# EAGLE design badge-pcb (EAGLE 7.7.0)
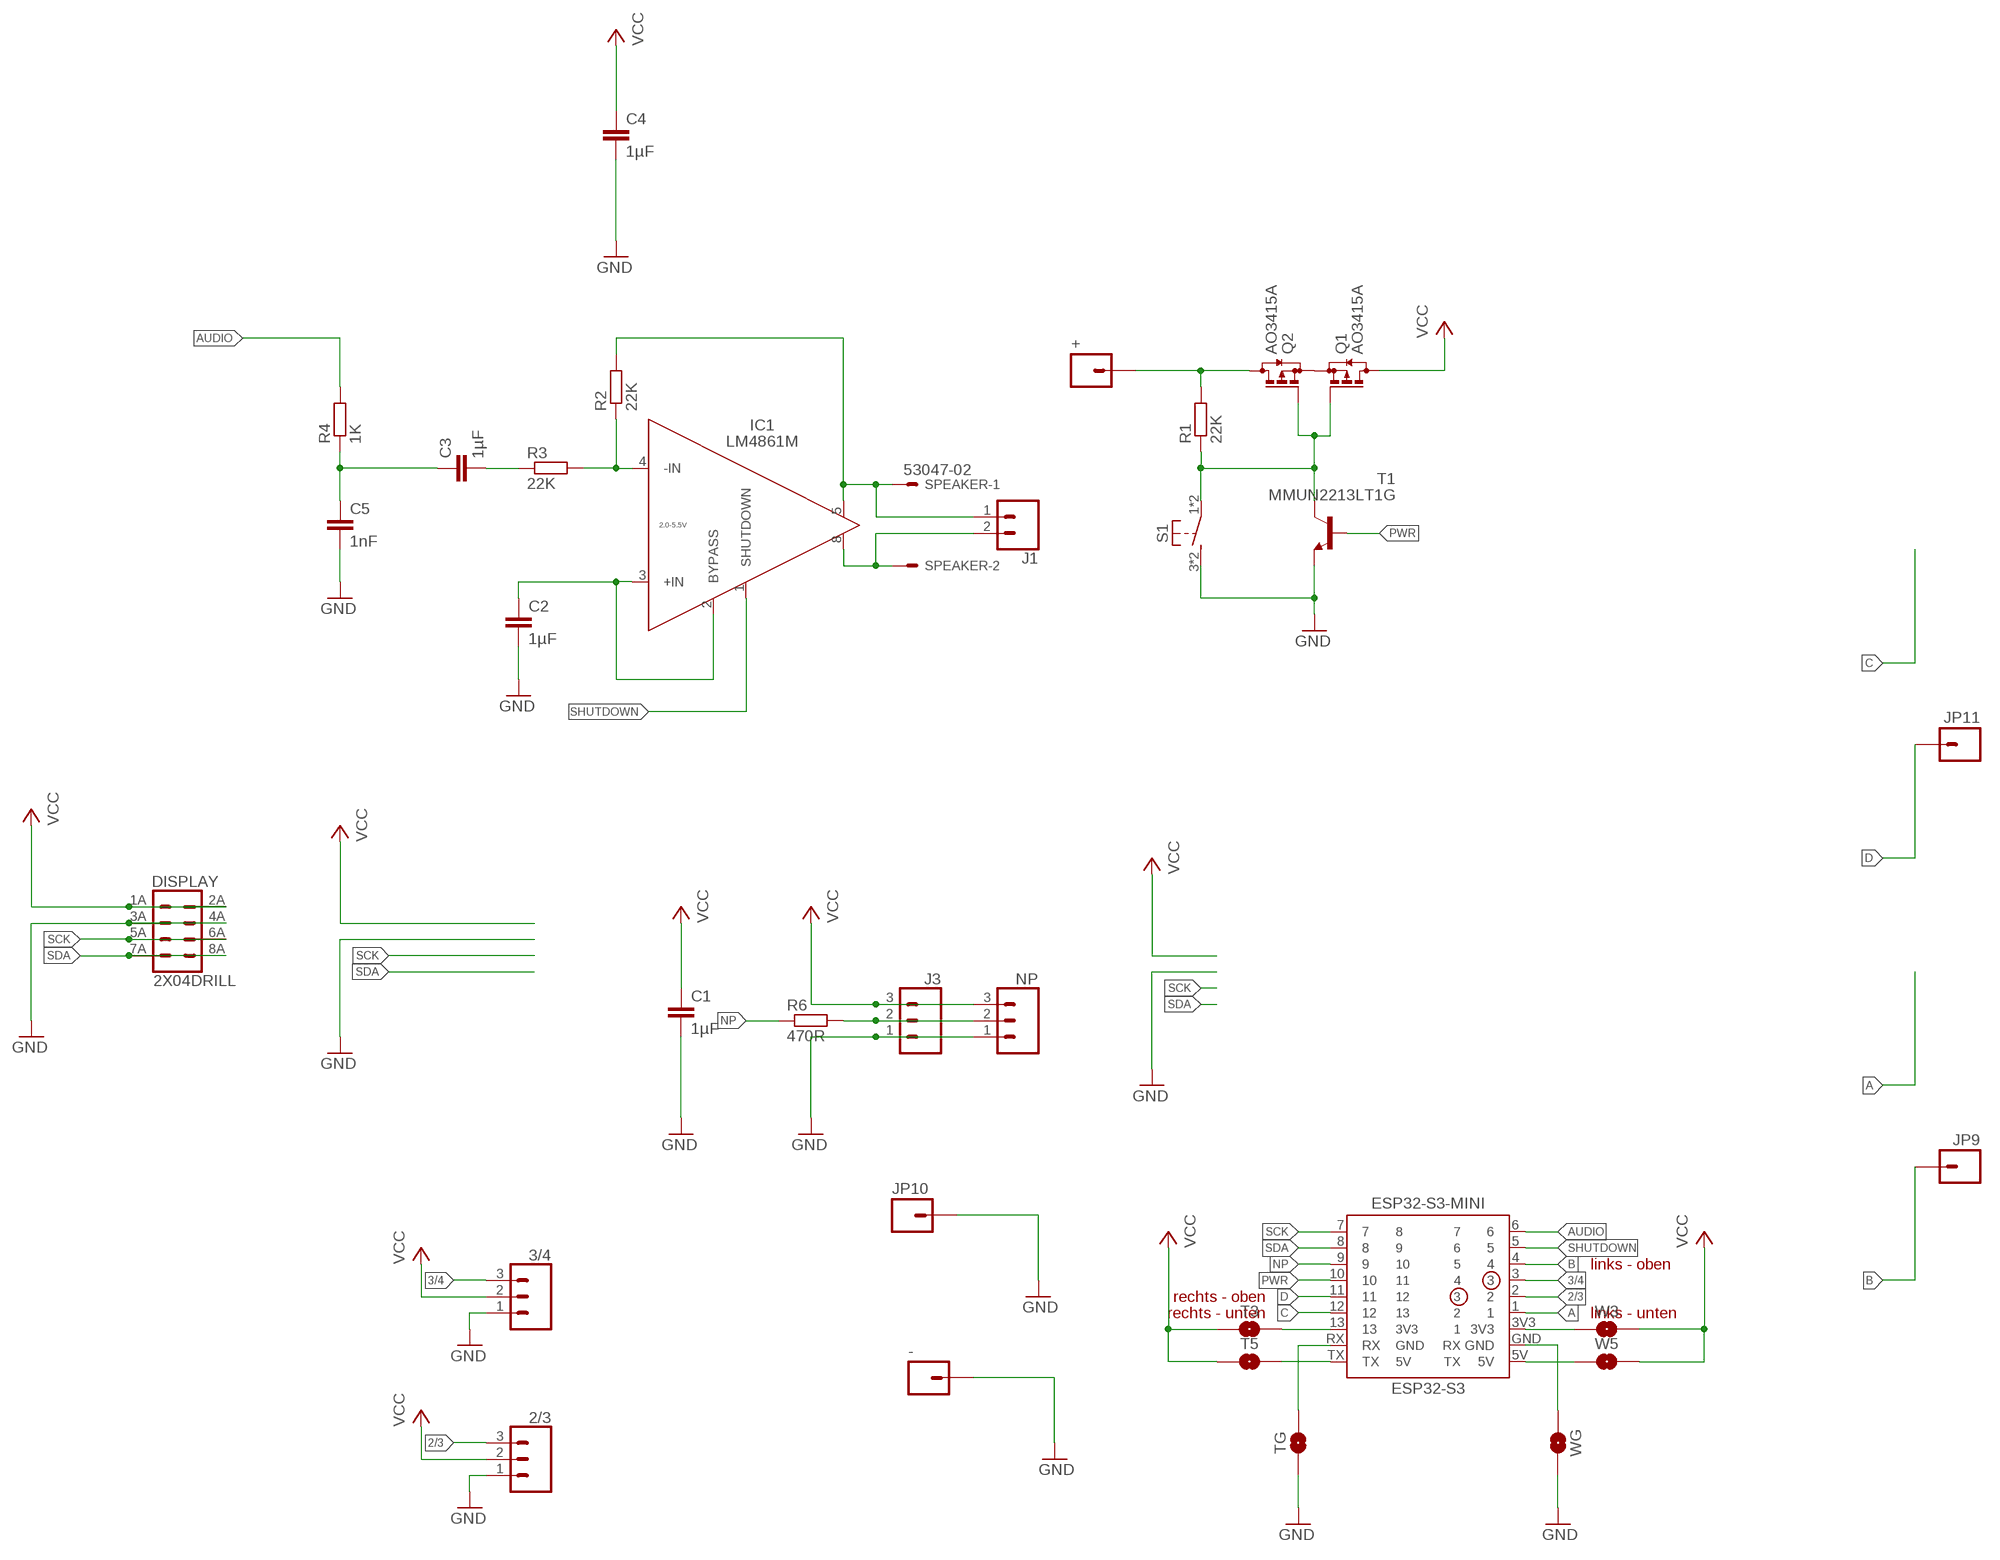
[diagram p0: schematic, sheet 1]

## Parts
2/3  455-1750-1-ND  CONN_03  [1X03]
3/4  455-1750-1-ND  CONN_03  [1X03]
+  M01OFFSET  [1X01_OFFSET]
-  M01OFFSET  [1X01_OFFSET]
C1  1µF  C-EUC0603K  [C0603K]
C2  1µF  C-EUC0603K  [C0603K]
C3  1µF  C-EUC0603K  [C0603K]
C4  1µF  C-EUC0603K  [C0603K]
C5  1nF  C-EUC0603K  [C0603K]
DISPLAY  2X04DRILL  [2X4-DRILL]
ESP32-S3  ESP32-S3-MINI  [ESP32-S3-MINI]
IC1  LM4861M  [SOIC8]
J1  CONN_02  [1X02]
J3  455-1750-1-ND  CONN_03LONGPADS  [1X03_LONGPADS]
JP9  M01OFFSET  [1X01_OFFSET]
JP10  M01PTH  [M01_1X01]
JP11  M01OFFSET  [1X01_OFFSET]
NP  455-1750-1-ND  CONN_03LONGPADS  [1X03_LONGPADS]
Q1  AO3415A  P-CHANNEL_MOSFETIRLML2244TRPBF  [SOT23-3PIN]
Q2  AO3415A  P-CHANNEL_MOSFETIRLML2244TRPBF  [SOT23-3PIN]
R1  22K  R-EU_R0603  [R0603]
R2  22K  R-EU_R0603  [R0603]
R3  22K  R-EU_R0603  [R0603]
R4  1K  R-EU_R0603  [R0603]
R6  470R  R-EU_R0603  [R0603]
S1  MOMENTARY-SWITCH-SPST-21138EM  [JTP-1138EM]
SPEAKER  53047-02  [53047-02]
T1  MMUN2213LT1G  BC847  [SOT23]
T3  JUMPER-SMT_2_NO_SILK  [SMT-JUMPER_2_NO_SILK]
T5  JUMPER-SMT_2_NO_SILK  [SMT-JUMPER_2_NO_SILK]
TG  JUMPER-SMT_2_NO_SILK  [SMT-JUMPER_2_NO_SILK]
W3  JUMPER-SMT_2_NO_SILK  [SMT-JUMPER_2_NO_SILK]
W5  JUMPER-SMT_2_NO_SILK  [SMT-JUMPER_2_NO_SILK]
WG  JUMPER-SMT_2_NO_SILK  [SMT-JUMPER_2_NO_SILK]

## Nets
2/3: 2/3.3 ESP32-S3.2
3/4: 3/4.3 ESP32-S3.3
A: ESP32-S3.1
AUDIO: ESP32-S3.6 R4.2
B: ESP32-S3.4 JP9.1
C: ESP32-S3.12
D: ESP32-S3.11 JP11.1
GND: 2/3.1 3/4.1 -.1 C1.2 C2.2 C4.2 C5.2 DISPLAY.3A DISPLAY.4A J3.1 JP10.1 NP.1 S1.3 S1.4 T1.2(E) TG.1 WG.1
N$1: ESP32-S3.3V3 W3.2
N$2: ESP32-S3.13 T3.2
N$3: ESP32-S3.RX TG.2
N$4: ESP32-S3.GND WG.2
N$5: Q1.2(S) Q2.2(S)
N$6: ESP32-S3.5V W5.2
N$7: +.1 Q2.3(D) R1.2
N$8: Q1.1(G) Q2.1(G) R1.1 S1.1 S1.2 T1.3(C)
N$9: IC1.8(VO2) J1.2 SPEAKER.2
N$10: ESP32-S3.TX T5.1
N$11: IC1.5(VO1) J1.1 R2.2 SPEAKER.1
N$12: IC1.4(-IN) R2.1 R3.2
N$13: C2.1 IC1.2(BYPASS) IC1.3(+IN)
N$14: C3.2 R3.1
N$15: C3.1 C5.1 R4.1
N$16: J3.2 NP.2 R6.2
NP: ESP32-S3.9 R6.1
PWR: ESP32-S3.10 T1.1(B)
SCK: DISPLAY.5A DISPLAY.6A ESP32-S3.7
SDA: DISPLAY.7A DISPLAY.8A ESP32-S3.8
SHUTDOWN: ESP32-S3.5 IC1.1(SHUTDOWN)
VCC: 2/3.2 3/4.2 C1.1 C4.1 DISPLAY.1A DISPLAY.2A J3.3 NP.3 Q1.3(D) T3.1 T5.2 W3.1 W5.1

## Notes on the sheet
- links - oben
- rechts - oben
- rechts - unten | links - unten

## Power pins joined to a net without a drawn wire
GND: IC1.7(GND)
VCC: IC1.6(VCC)

## Library data of the parts
2/3 3/4 = SparkFun-Connectors:CONN_03: Multi connection point. Often used as Generic Header-pin footprint for 0.1 inch spaced/style header connections On any of the 0.1 inch spaced packages, you can populate with these: Break Away Headers - Straight <https://www.sparkfun.com/products/116> (PRT-00116) Break Away Male Headers - Right Angle <https://www.sparkfun.com/products/553> (PRT-00553) Female Headers <https://www.sparkfun.com/products/115> (PRT-00115) Break Away Headers - Machine Pin <https://www.sparkfun.com/products/117> (PRT-00117) Break Away Female Headers - Swiss Machine Pin <https://www.sparkfun.com/products/743> (PRT-00743) Stackable Header - 3 Pin (Female, 0.1") <https://www.sparkfun.com/products/13875> (PRT-13875) For SCREWTERMINALS and SPRING TERMINALS visit here: Screw Terimnals on SparkFun.com <https://www.sparkfun.com/search/results?term=Screw+Terminals> (5mm/3.5mm/2.54mm spacing) This device is also useful as a general connection point to wire up your design to another part of your project. Our various solder wires solder well into these plated through hole pads. Hook-Up Wire - Assortment (Stranded, 22 AWG) <https://www.sparkfun.com/products/11375> (PRT-11375) Hook-Up Wire - Assortment (Solid Core, 22 AWG) <https://www.sparkfun.com/products/11367> (PRT-11367) View the entire wire category on our website here <https://www.sparkfun.com/categories/141> Special notes: Molex polarized connector foot print use with SKU : PRT-08232 with associated crimp pins and housings.; PROD_ID: XXX-00000
+ - JP9-JP11 = MyEagleLibrary:M01: Header 1 Standard 1-pin 0.1" header. Use with straight break away headers (SKU : PRT-00116), right angle break away headers (PRT-00553), swiss pins (PRT-00743), machine pins (PRT-00117), and female headers (PRT-00115).
C1-C5 = rcl:C-EU: CAPACITOR, European symbol
DISPLAY = hackffm_badge:2X04
ESP32-S3 = hackffm_badge:ESP32-S3-MINI
IC1 = hackffm_badge:LM4861M
J1 = SparkFun-Connectors:CONN_02: Multi connection point. Often used as Generic Header-pin footprint for 0.1 inch spaced/style header connections On any of the 0.1 inch spaced packages, you can populate with these: Break Away Headers - Straight <https://www.sparkfun.com/products/116> (PRT-00116) Break Away Male Headers - Right Angle <https://www.sparkfun.com/products/553> (PRT-00553) Female Headers <https://www.sparkfun.com/products/115> (PRT-00115) Break Away Headers - Machine Pin <https://www.sparkfun.com/products/117> (PRT-00117) Break Away Female Headers - Swiss Machine Pin <https://www.sparkfun.com/products/743> (PRT-00743) For SCREWTERMINALS and SPRING TERMINALS visit here: Screw Terimnals on SparkFun.com <https://www.sparkfun.com/search/results?term=Screw+Terminals> (5mm/3.5mm/2.54mm spacing) This device is also useful as a general connection point to wire up your design to another part of your project. Our various solder wires solder well into these plated through hole pads. Hook-Up Wire - Assortment (Stranded, 22 AWG) <https://www.sparkfun.com/products/11375> (PRT-11375) Hook-Up Wire - Assortment (Solid Core, 22 AWG) <https://www.sparkfun.com/products/11367> (PRT-11367) View the entire wire category on our website here <https://www.sparkfun.com/categories/141> Special notes: Molex polarized connector foot print use with: PRT-08233 with associated crimp pins and housings. 2.54_SCREWTERM for use with PRT-10571. 3.5mm Screw Terminal footprints for PRT-08084 5mm Screw Terminal footprints for use with PRT-08432
J3 NP = SparkFun-Connectors:CONN_03: Multi connection point. Often used as Generic Header-pin footprint for 0.1 inch spaced/style header connections On any of the 0.1 inch spaced packages, you can populate with these: Break Away Headers - Straight <https://www.sparkfun.com/products/116> (PRT-00116) Break Away Male Headers - Right Angle <https://www.sparkfun.com/products/553> (PRT-00553) Female Headers <https://www.sparkfun.com/products/115> (PRT-00115) Break Away Headers - Machine Pin <https://www.sparkfun.com/products/117> (PRT-00117) Break Away Female Headers - Swiss Machine Pin <https://www.sparkfun.com/products/743> (PRT-00743) Stackable Header - 3 Pin (Female, 0.1") <https://www.sparkfun.com/products/13875> (PRT-13875) For SCREWTERMINALS and SPRING TERMINALS visit here: Screw Terimnals on SparkFun.com <https://www.sparkfun.com/search/results?term=Screw+Terminals> (5mm/3.5mm/2.54mm spacing) This device is also useful as a general connection point to wire up your design to another part of your project. Our various solder wires solder well into these plated through hole pads. Hook-Up Wire - Assortment (Stranded, 22 AWG) <https://www.sparkfun.com/products/11375> (PRT-11375) Hook-Up Wire - Assortment (Solid Core, 22 AWG) <https://www.sparkfun.com/products/11367> (PRT-11367) View the entire wire category on our website here <https://www.sparkfun.com/categories/141> Special notes: Molex polarized connector foot print use with SKU : PRT-08232 with associated crimp pins and housings.
Q1 Q2 = MyEagleLibrary:P-CHANNEL_MOSFET
R1-R4 R6 = rcl:R-EU_: RESISTOR, European symbol
S1 = DCEM-FeatherWings (conflicted):MOMENTARY-SWITCH-SPST-2: Momentary Switch (Pushbutton) - SPST - Two Circuits Normally-open (NO) SPST momentary switches (buttons, pushbuttons). Schematic symbol includes two switch circuits. Variants SMD-4.6MMX2.8MM - 4.60mm x 2.80mm Tactile Momentary Button Switch - Used on SparkFun Pro Micro - RP2040 <https://www.sparkfun.com/products/17717> SMD-5.2MM - Mini Pushbutton Switch - SMD <https://www.sparkfun.com/products/8720> - Used on Arduino Pro Mini <https://www.sparkfun.com/products/11114>
SPEAKER = con-molex:53?-02: CONNECTOR wire to board 1.25 mm (.049 inch) pitch header; MF: MOLEX; MPN: 53047-0210; OC_FARNELL: 9733051; OC_NEWARK: 57H4701
T1 = transistor:BC847: NPN TRANSISTOR
T3 T5 TG W3 W5 WG = SparkFun-Jumpers:JUMPER-SMT_2_NO: Normally open jumper This jumper has two pads in close proximity to each other. Apply solder to close the connection. Round pads are easier to solder for beginners, but are a lot larger. SparkFun Product that uses the round pads: SparkFun EL Sequencer <https://www.sparkfun.com/products/12781>

## Board
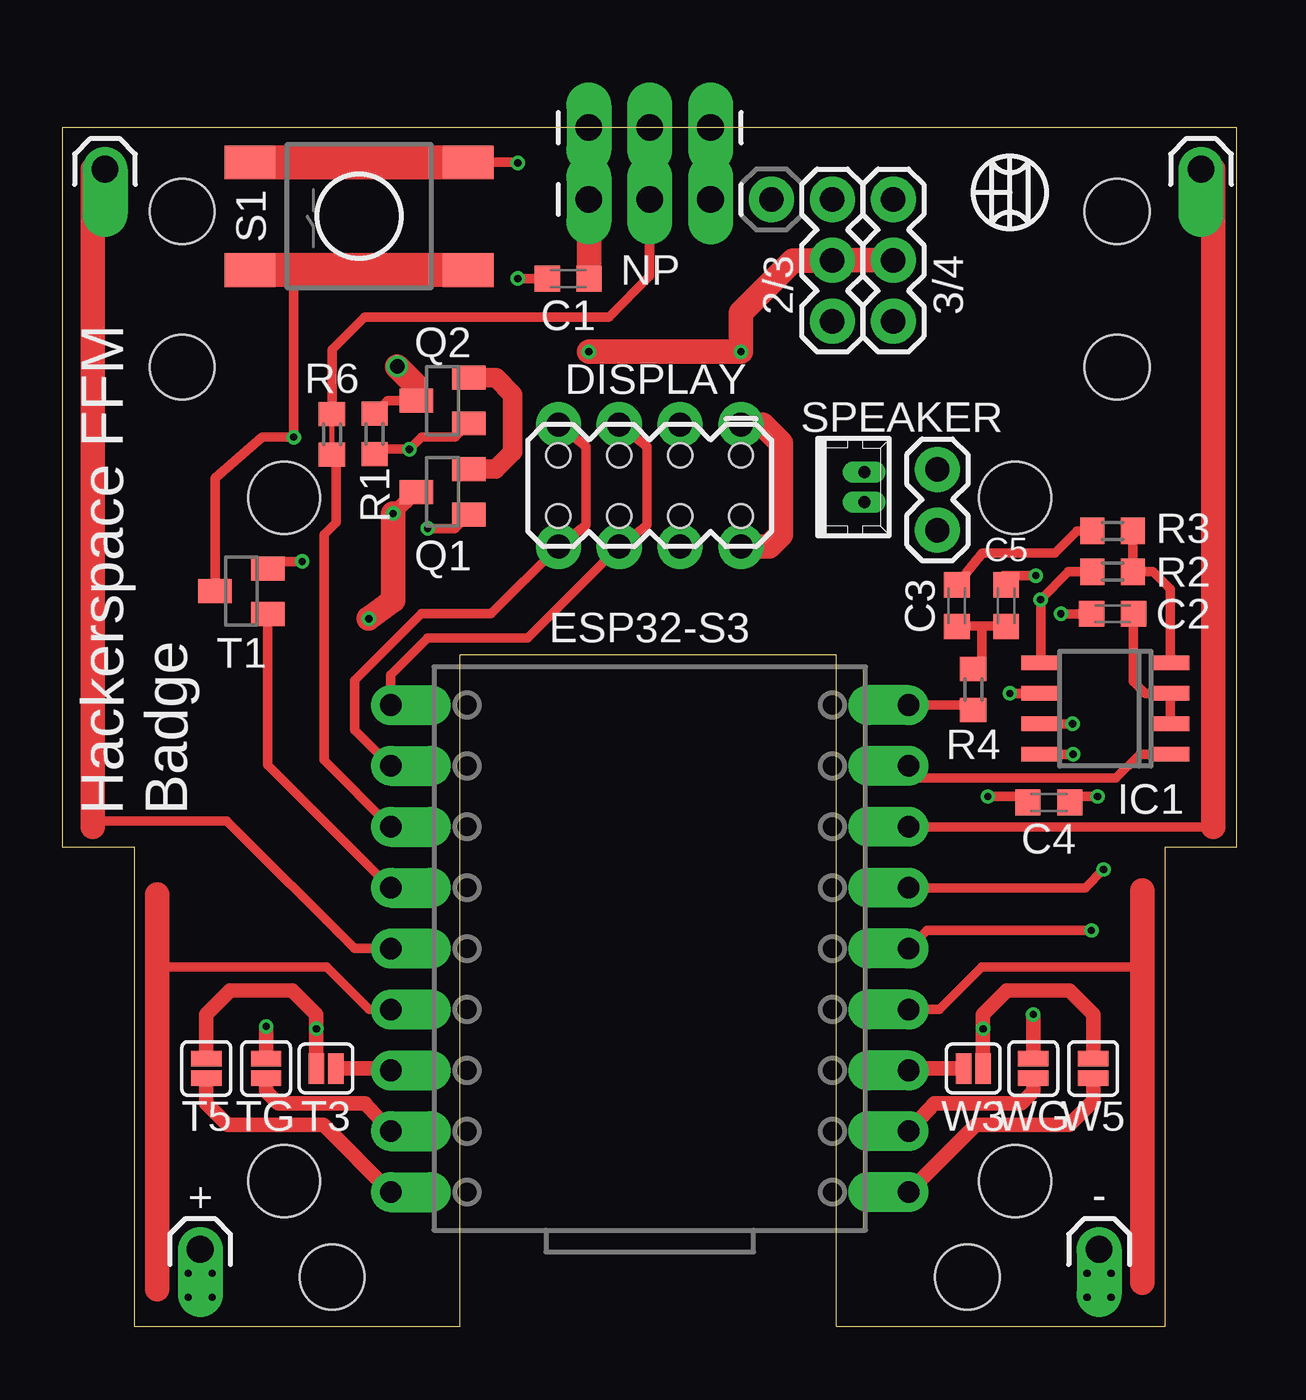
[diagram p1: board, top side]
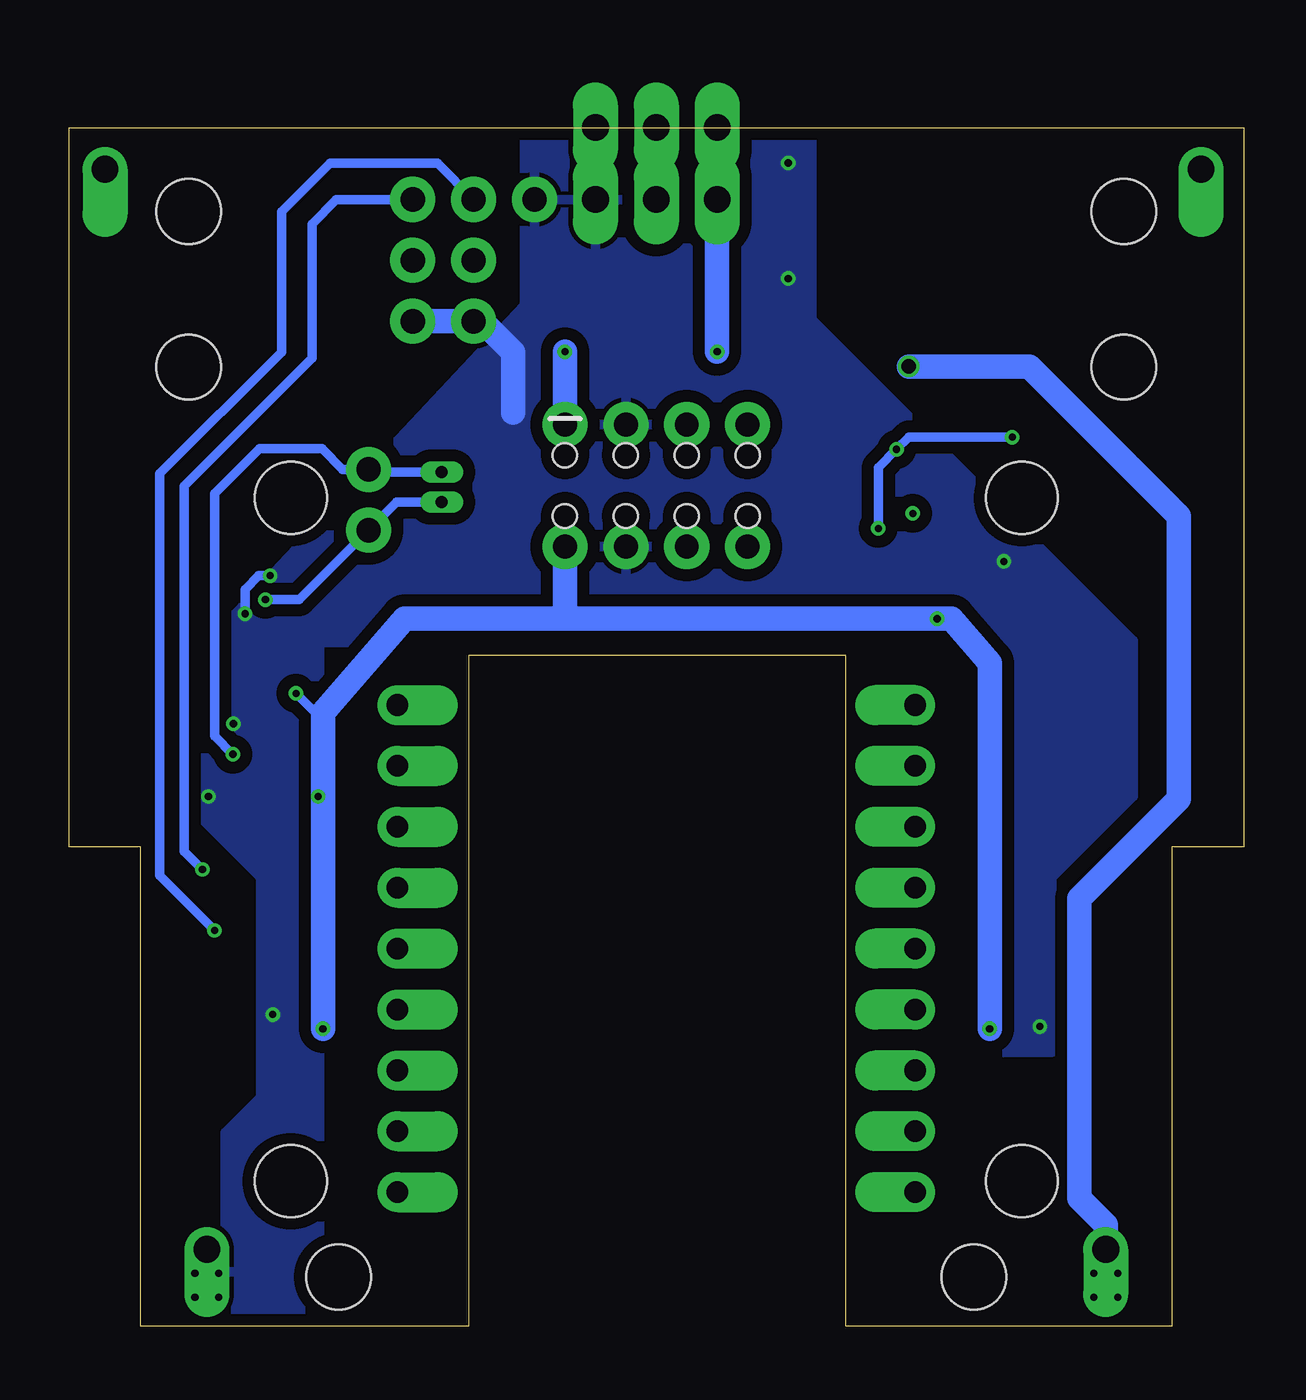
[diagram p2: board, bottom side, seen from below]

Size 49 x 50 mm. Coordinates in mm from the lower left corner, seen from the top.
Outline: 3,0 16.6,0 16.6,28 32.3,28 32.3,0 46,0 46,20 49,20 49,50 0,50 0,20 3,20 3,0
Copper layers (1*16): Top 0.035mm / dielectric 1.5mm / Bottom 0.035mm
Design rules "PCB-POOL Standard": minimum track width 0.15mm, minimum drill 0.3mm, track to track 0.15mm, track to pad 0.15mm, pad to pad 0.15mm, via to via 0.15mm, smd to smd 0.15mm, copper to edge 0.3mm, drill to drill 0.2mm, minimum pad ring 0.2mm, minimum via ring 0.15mm, stop-mask expansion 0.075mm, vias tented up to drill 0.3mm, thermal gap 0.2mm
Holes 3 mm at 9.25,6.05 39.75,6.05 39.75,34.55 9.25,34.55
Holes 2.7 mm at 11.25,2.05 37.75,2.05 5,46.5 44,46.5 5,40 44,40

### Footprints (pad centres in the part's own frame; a part is rotated, then mirrored left to right if it is on the bottom)
1X03 = drill 1.016 pad 1.88: 1 0,0; 2 2.54,0; 3 5.08,0
1X01_OFFSET = drill 1.118 pad 1.88 offset: 1 0,0
C0603K = smd 1.05 x 1.08: 1 -0.875,0; 2 0.875,0
2X4-DRILL = drill 1 pad 1.88: 1A 0,-1.27; 2A 0,3.81; 3A 2.54,-1.27; 4A 2.54,3.81; 5A 5.08,-1.27; 6A 5.08,3.81; 7A 7.62,-1.27; 8A 7.62,3.81 | hole 1: 0,0; 2.54,0; 5.08,0; 7.62,0; 0,2.54; 2.54,2.54; 5.08,2.54; 7.62,2.54
ESP32-S3-MINI = drill 0.9 pad 1.676 offset: 1 -10.8,-9.21; 2 -10.8,-11.75; 3 -10.8,-14.29; 3V3 -10.8,-6.67; 4 -10.8,-16.83; 5 -10.8,-19.37; 5V -10.8,-1.59; 6 -10.8,-21.91; 7 10.8,-21.91; 8 10.8,-19.37; 9 10.8,-16.83; 10 10.8,-14.29; 11 10.8,-11.75; 12 10.8,-9.21; 13 10.8,-6.67; GND -10.8,-4.13; RX 10.8,-4.13; TX 10.8,-1.59
SOIC8 = smd 0.61 x 1.6: 1 -1.905,-2.7; 2 -0.635,-2.7; 3 0.635,-2.7; 4 1.905,-2.7; 5 1.905,2.7; 6 0.635,2.7; 7 -0.635,2.7; 8 -1.905,2.7
1X02 = drill 1.016 pad 1.88: 1 0,0; 2 2.54,0
1X03_LONGPADS = drill 1.118 pad 1.88 long: 1 0,0; 2 2.54,0; 3 5.08,0
M01_1X01 = drill 1.016 pad 1.88: 1 0,0
SOT23-3PIN = smd 1 x 1.4: 1 -0.95,-1.1; 2 0.95,-1.1; 3 0,1.1
R0603 = smd 1 x 1.1: 1 -0.85,0; 2 0.85,0
JTP-1138EM = smd 2.1 x 1.4: 1 -4.55,2.25; 2 4.55,2.25; 3 -4.55,-2.25; 4 4.55,-2.25
53047-02 = drill 0.5 pad 0.698 long: 1 0.625,0.45; 2 -0.625,0.45
SOT23 = smd 1 x 1.4: 1 -0.95,-1.1; 2 0.95,-1.1; 3 0,1.1
SMT-JUMPER_2_NO_SILK = smd 0.635 x 1.27: 1 -0.406,0; 2 0.406,0

### Placement (x,y rotation side)
2/3  32.12,41.92 90 top
3/4  34.66,41.92 90 top
+  5.75,3.2 180 top
-  43.25,3.2 180 top
C1  21.1,43.7 180 top
C2  43.81,29.72 180 top
C3  37.31,30.05 90 top
C4  41.15,21.84 0 top
C5  39.37,30.05 90 top
DISPLAY  28.31,36.33 180 top
ESP32-S3  24.5,4 180 top
IC1  43.51,25.76 90 top
J1  36.5,33.2 90 top
J3  27.04,50 180 top
JP9  47.5,48.26 180 top
JP10  29.58,47 0 top
JP11  1.78,48.26 180 top
NP  27.04,47 180 top
Q1  15.86,34.8 90 top
Q2  15.86,38.61 90 top
R1  13.03,37.22 90 top
R2  43.81,31.47 180 top
R3  43.81,33.17 0 top
R4  38,26.56 270 top
R6  11.25,37.2 90 top
S1  12.38,46.3 180 top
SPEAKER  33,35 270 top
T1  7.47,30.66 90 top
T3  11,10.75 0 top
T5  6,10.75 90 top
TG  8.5,10.75 270 top
W3  38,10.75 180 top
W5  43,10.75 270 top
WG  40.5,10.75 270 top

### Tracks (layer width: path | path; a pad name or v marks a point on that pad's centre or on a via)
2/3  (via drill 0.3)
  Top 0.406: ESP32-S3.2 36.06,16.51 v42.93,16.51
  Bottom 0.406: v42.93,16.51 45.21,18.8 45.21,35.56 40.13,40.64 40.13,46.48 38.1,48.51 33.63,48.51 2/3.3
3/4  (via drill 0.3)
  Top 0.406: ESP32-S3.3 42.67,18.29 v43.43,19.05
  Bottom 0.406: v43.43,19.05 44.2,19.81 44.2,35.05 38.86,40.39 38.86,45.97 37.85,46.99 3/4.3
A
  Top 0.406: ESP32-S3.1 36.58,13.21 38.35,14.99 45.05,14.99
  Top 1.016: 45.05,1.8 45.05,14.99 45.05,18.18
AUDIO
  Top 0.406: ESP32-S3.6 37.8,25.91 R4.2
B
  Top 0.406: ESP32-S3.4 48.01,20.83 48.01,21.59
  Top 1.016: JP9.1 48.01,48.26 48.01,21.59 48.01,20.83
C
  Top 0.406: 3.95,14.99 11.01,14.99 12.79,13.21 ESP32-S3.12 | 3.95,6.1 3.95,8.89
  Top 1.016: 3.95,1.55 3.95,8.89 3.95,14.99 3.95,18
D
  Top 0.406: ESP32-S3.11 12.19,15.75 6.86,21.08 1.27,21.08
  Top 1.016: 1.27,20.83 1.27,21.08 1.27,48.26 JP11.1
GND  (via drill 0.3)
  Top 0.406: C1.2 v19,43.7 | T1.2 8.86,31.9 v10,31.9 | IC1.7 v42.14,25.13 | v40.61,31.31 39.26,31.31 39.26,31.04 C5.2 | C4.2 42.28,22.1 v43.18,22.1 | S1.3 19,48.55 v19,48.53 | C2.2 v41.66,29.72
  Top 0.61: WG.1 v40.5,13 | TG.1 v8.5,12.5
  Top 1.016: 8.04,48.55 S1.4
  Top 1.422: 8.04,48.55 16.46,48.55
  Bottom 0.406: v42.75,1.2 v43.75,1.2 | v43.75,2.2 v42.75,2.2 | 40.83,31.31 v40.61,31.31 41.08,31.31 41.66,30.73 v41.66,29.72
  Bottom 0.61: v43.75,1.2 v43.75,2.2 43.75,2.7 -.1
  Bottom 1.016: 3/4.1 2/3.1 31.76,41.92 30.48,40.64 30.48,38.1
  pour Bottom (isolate 0.5): 8,11.43 8,18.7 4.6,22.1 4.6,28.6 18,42 18,50 30,50 30,42.6 44.4,27.2 44.4,22.1 41,18.7 41,9.56 42.48,8.08 42.48,4.26 43.94,2.79 44,0 38.54,0 38.54,28.51 17.78,28.51 17.78,11.43
N$1
  Top 0.61: ESP32-S3.3V3 35.3,10.75 W3.2
N$2
  Top 0.61: ESP32-S3.13 13.7,10.75 T3.2
N$3
  Top 0.61: ESP32-S3.RX 12.62,9.3 9,9.3 8.5,9.8 TG.2
N$4
  Top 0.61: ESP32-S3.GND 36.38,9.3 40,9.3 40.5,9.8 WG.2
N$5
  Top 0.813: Q2.2 18.09,39.56 18.78,38.86 18.78,36.45 18.08,35.75 Q1.2
N$6
  Top 0.61: ESP32-S3.5V 38.11,8.4 42,8.4 43,9.4 W5.2
N$7  (via drill 0.3, 0.6)
  Top 0.406: 14.51,38.86 Q2.3 13.57,38.61 R1.2
  Top 1.016: v13.97,40.03 14.76,39.24 Q2.3
  Bottom 0.406: v6.25,1.2 5.75,1.2 | v5.25,1.2 5.75,1.2 | 5.75,1.2 5.75,2.2 | 5.75,2.2 +.1 | v5.25,2.2 5.75,2.2 | 5.75,2.2 v6.25,2.2
  Bottom 1.016: v13.97,40.03 8.93,40.03 2.7,33.8 2.7,22 6.86,17.84 6.86,5.33 5.75,4.23 +.1
N$8  (via drill 0.3)
  Top 0.406: T1.3 6.37,35.37 8.34,37.08 v9.65,37.08 9.65,44.05 | 8.38,44.05 7.11,44.05 | Q1.1 16.38,33.27 v15.24,33.27 | R1.1 13.23,36.58 v14.48,36.58 14.99,37.08 16.38,37.08 Q2.1
  Top 1.422: S1.1 9.65,44.05 8.38,44.05
  Bottom 0.406: v9.65,37.08 13.97,37.08 v14.48,36.58 15.24,35.81 v15.24,33.27
N$9  (via drill 0.3)
  Top 0.406: IC1.8 v42.16,23.86
  Bottom 0.406: SPEAKER.2 36.38,35.62 J1.2 37.59,35.74 38.45,36.6 41.05,36.6 42.93,34.73 42.93,24.62 v42.16,23.86
N$10
  Top 0.61: ESP32-S3.TX 10.89,8.4 6.9,8.4 6,9.3 T5.1
N$11  (via drill 0.3)
  Top 0.406: 40.51,27.67 IC1.5 v40.81,30.31 41.97,31.47 R2.2
  Bottom 0.406: v40.81,30.31 39.39,30.31 J1.1 35.33,34.38 SPEAKER.1
N$12
  Top 0.406: IC1.4 46.21,30.75 45.49,31.47 R2.1 R3.2
N$13
  Top 0.406: IC1.2 IC1.3 45.17,26.4 44.68,26.89 C2.1
N$14
  Top 0.406: C3.2 38.38,32.26 41.4,32.26 42.31,33.17 R3.1
N$15
  Top 0.406: C3.1 37.33,29.2 38.35,29.2 | R4.1 38.35,27.66 38.35,29.2 | C5.1 39.34,29.2 38.35,29.2
N$16
  Top 0.203: 11.25,36.27 11.25,37.94
  Top 0.406: 11.25,37.94 R6.2 11.25,40.74 12.6,42.09 22.8,42.09 24.5,43.79 NP.2
  Bottom 0.406: NP.2 J3.2
NP
  Top 0.406: ESP32-S3.9 10.92,23.61 10.92,33.02 11.43,33.53 11.43,36.07 11.25,36.25 R6.1
PWR
  Top 0.406: ESP32-S3.10 8.57,23.42 T1.1
SCK
  Top 0.406: DISPLAY.5A 24.38,36.7 24.38,33.42 DISPLAY.6A 19.41,28.7 15.24,28.7 13.7,27.16 ESP32-S3.7
SDA
  Top 0.406: DISPLAY.7A 21.84,36.7 21.84,33.42 DISPLAY.8A 17.89,29.72 14.99,29.72 12.19,26.92 12.19,24.88 ESP32-S3.8
SHUTDOWN
  Top 0.406: ESP32-S3.5 35.81,22.86 43.94,22.86 44.94,23.86 IC1.1
VCC  (via drill 0.3)
  Top 0.406: v39.53,26.4 IC1.6 | C4.1 40.53,22.1 v38.61,22.1
  Top 0.61: T3.1 v10.59,12.41 10.59,13 9.59,14 7,14 6,13 T5.2 | W3.1 v38.41,12.41 38.41,13 39.41,14 42,14 43,13 W5.1 | Q1.3 v13.8,33.9
  Top 1.016: C1.1 21.96,43.72 NP.3 | v21.96,40.65 v28.31,40.65 28.31,42.28 30.48,44.45 31.35,44.45 31.36,44.46 2/3.2 3/4.2 | DISPLAY.2A 29.47,32.52 29.97,33.02 29.97,36.83 29.2,37.6 DISPLAY.1A | v12.78,29.51 13.8,30.27 v13.8,33.9
  Bottom 0.406: v38.61,22.1 38.41,22.1 | v39.53,26.4 38.53,25.4 38.41,25.4
  Bottom 1.016: v10.59,12.41 10.59,27.66 12.19,29.51 v12.78,29.51 28.31,29.51 | v38.41,12.41 38.41,22.1 38.41,25.4 38.41,25.59 35,29.51 28.31,29.51 | v21.96,40.65 NP.3 J3.3 | DISPLAY.2A 28.31,29.51 | DISPLAY.1A v28.31,40.65

### Text on the board
tPlace: Hackerspace FFM / Badge